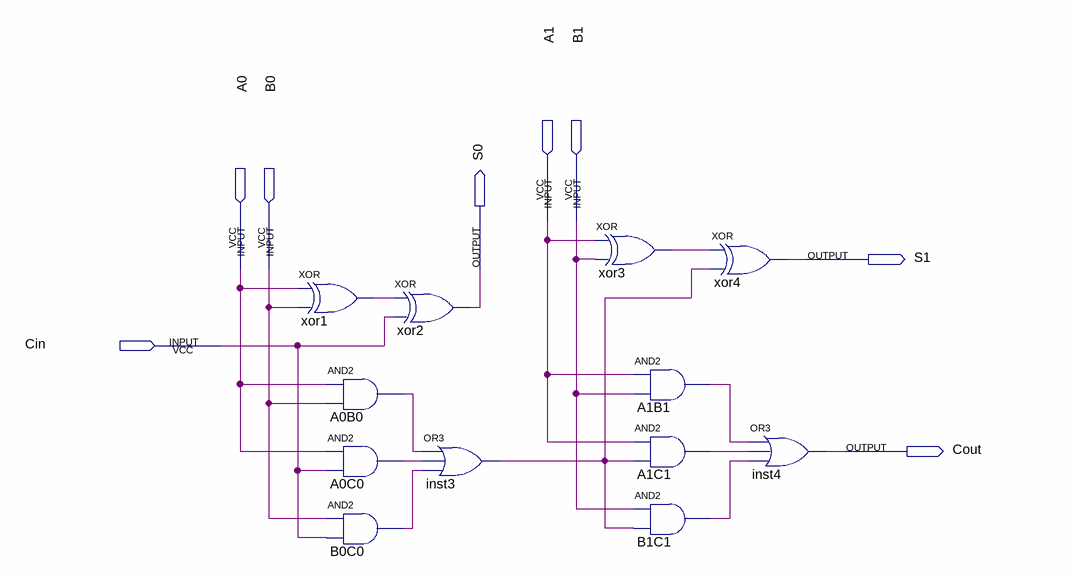
[diagram p0: schematic sheet]
// Quartus schematic Question1p2.bdf as structural Verilog: 12 symbols, 8 pins
module Question1p2 (
  input  A1,
  input  B1,
  input  A0,
  input  B0,
  input  Cin,
  output S1,
  output S0,
  output Cout
);

  wire A0B0_out, A0C0_out, A1B1_out, A1C1_out, B0C0_out, B1C1_out, inst3_out, xor1_out, xor3_out;

  xor xor1 (xor1_out, A0, B0);
  and A0B0 (A0B0_out, A0, B0);
  and A0C0 (A0C0_out, A0, Cin);
  and B0C0 (B0C0_out, B0, Cin);
  xor xor2 (S0, xor1_out, Cin);
  or inst3 (inst3_out, A0B0_out, A0C0_out, B0C0_out);
  xor xor3 (xor3_out, A1, B1);
  and A1B1 (A1B1_out, A1, B1);
  and A1C1 (A1C1_out, A1, inst3_out);
  and B1C1 (B1C1_out, B1, inst3_out);
  xor xor4 (S1, xor3_out, inst3_out);
  or inst4 (Cout, A1B1_out, A1C1_out, B1C1_out);
endmodule
